# EAGLE design co326_serial_3_2 (EAGLE 9.3.0)
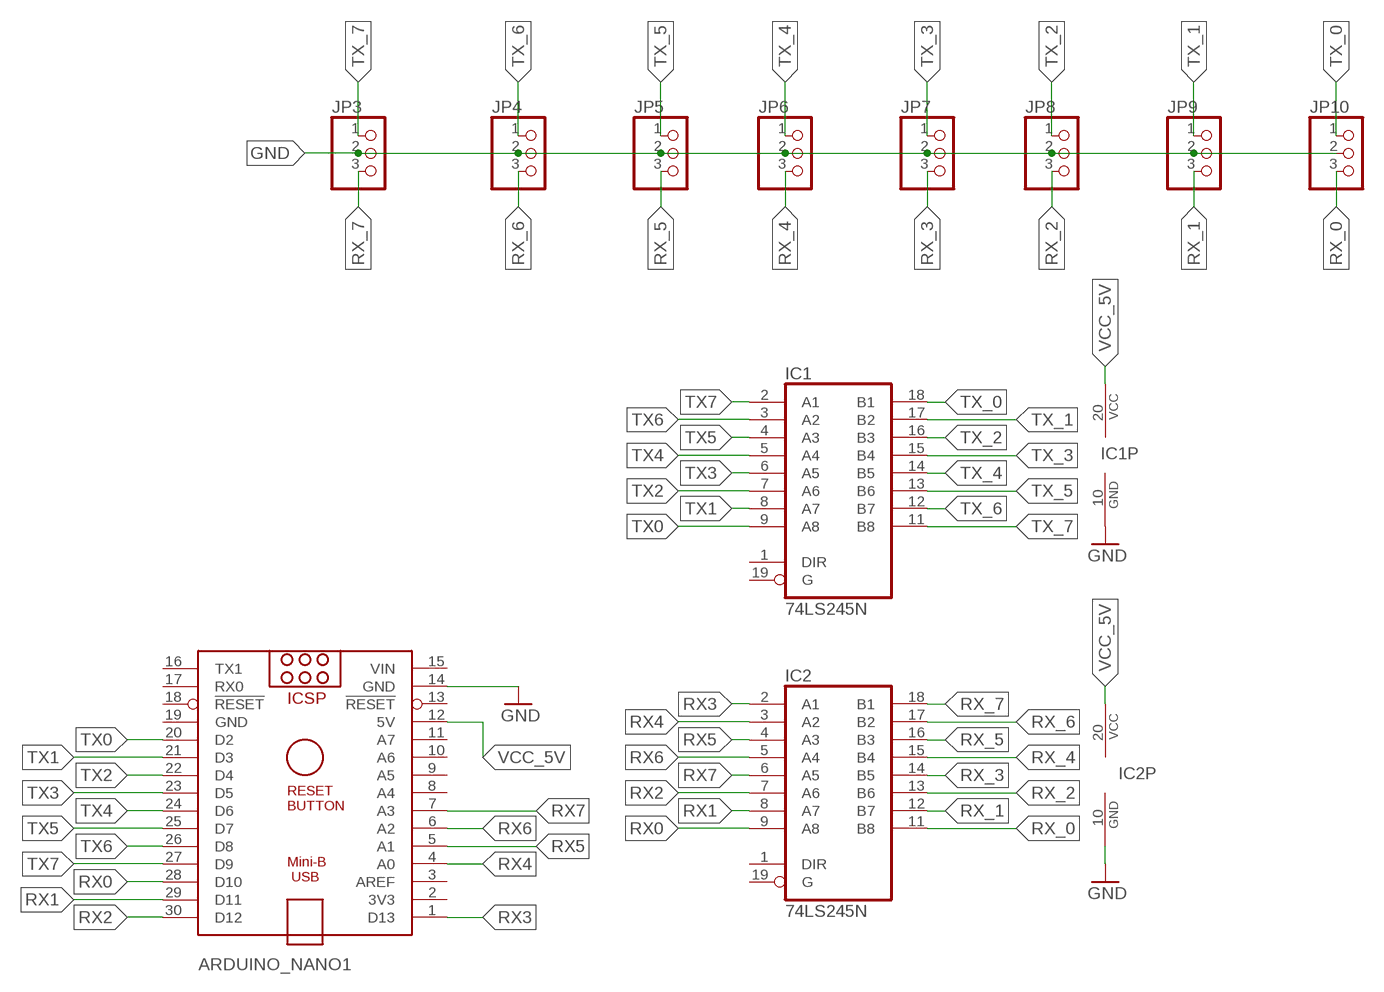
[diagram p0: schematic, sheet 1]

## Parts
ARDUINO_NANO1  ARDUINO_NANO  [ARDUINO_NANO]
IC1  74LS245N  [DIL20]
IC2  74LS245N  [DIL20]
JP3  PINHD-1X3  [1X03]
JP4  PINHD-1X3  [1X03]
JP5  PINHD-1X3  [1X03]
JP6  PINHD-1X3  [1X03]
JP7  PINHD-1X3  [1X03]
JP8  PINHD-1X3  [1X03]
JP9  PINHD-1X3  [1X03]
JP10  PINHD-1X3  [1X03]

## Nets
GND: ARDUINO_NANO1.14(GND) IC1.10(GND) IC2.10(GND) JP3.2 JP4.2 JP5.2 JP6.2 JP7.2 JP8.2 JP9.2 JP10.2
RX0: ARDUINO_NANO1.28(D10) IC2.9(A8)
RX1: ARDUINO_NANO1.29(D11) IC2.8(A7)
RX2: ARDUINO_NANO1.30(D12) IC2.7(A6)
RX3: ARDUINO_NANO1.1(D13) IC2.2(A1)
RX4: ARDUINO_NANO1.4(A0) IC2.3(A2)
RX5: ARDUINO_NANO1.5(A1) IC2.4(A3)
RX6: ARDUINO_NANO1.6(A2) IC2.5(A4)
RX7: ARDUINO_NANO1.7(A3) IC2.6(A5)
RX_0: IC2.11(B8) JP10.3
RX_1: IC2.12(B7) JP9.3
RX_2: IC2.13(B6) JP8.3
RX_3: IC2.14(B5) JP7.3
RX_4: IC2.15(B4) JP6.3
RX_5: IC2.16(B3) JP5.3
RX_6: IC2.17(B2) JP4.3
RX_7: IC2.18(B1) JP3.3
TX0: ARDUINO_NANO1.20(D2) IC1.9(A8)
TX1: ARDUINO_NANO1.21(D3) IC1.8(A7)
TX2: ARDUINO_NANO1.22(D4) IC1.7(A6)
TX3: ARDUINO_NANO1.23(D5) IC1.6(A5)
TX4: ARDUINO_NANO1.24(D6) IC1.5(A4)
TX5: ARDUINO_NANO1.25(D7) IC1.4(A3)
TX6: ARDUINO_NANO1.26(D8) IC1.3(A2)
TX7: ARDUINO_NANO1.27(D9) IC1.2(A1)
TX_0: IC1.18(B1) JP10.1
TX_1: IC1.17(B2) JP9.1
TX_2: IC1.16(B3) JP8.1
TX_3: IC1.15(B4) JP7.1
TX_4: IC1.14(B5) JP6.1
TX_5: IC1.13(B6) JP5.1
TX_6: IC1.12(B7) JP4.1
TX_7: IC1.11(B8) JP3.1
VCC_5V: ARDUINO_NANO1.12(5V) IC1.20(VCC) IC2.20(VCC)
Unconnected: ARDUINO_NANO1.2(3V3) ARDUINO_NANO1.3(AREF) ARDUINO_NANO1.8(A4) ARDUINO_NANO1.9(A5) ARDUINO_NANO1.10(A6) ARDUINO_NANO1.11(A7) ARDUINO_NANO1.13(!RESET) ARDUINO_NANO1.16(TX1) ARDUINO_NANO1.17(RX0) ARDUINO_NANO1.18(!RESET) IC1.1(DIR) IC1.19(G) IC2.1(DIR) IC2.19(G)

## Power pins joined to a net without a drawn wire
GND: ARDUINO_NANO1.19(GND)
VIN: ARDUINO_NANO1.15(VIN)

## Library data of the parts
ARDUINO_NANO1 = ArduinoNanoV30:ARDUINO_NANO: Arduino Nano V3.0 Overview: The Arduino Nano is a small, complete, and breadboard-friendly board based on the ATmega328 (Arduino Nano 3.x) or ATmega168 (Arduino Nano 2.x). It has more or less the same functionality of the Arduino Duemilanove, but in a different package. It lacks only a DC power jack, and works with a Mini-B USB cable instead of a standard one. The Nano was designed and is being produced by Gravitech. Specifications: Microcontroller Atmel ATmega168 or ATmega328 Operating Voltage (logic level) 5 V Input Voltage (recommended) 7-12 V Input Voltage (limits) 6-20 V Digital I/O Pins 14 (of which 6 provide PWM output) Analog Input Pins 8 DC Current per I/O Pin 40 mA Flash Memory 16 KB (ATmega168) or 32 KB (ATmega328) of which 2 KB used by bootloader SRAM 1 KB (ATmega168) or 2 KB (ATmega328) EEPROM 512 bytes (ATmega168) or 1 KB (ATmega328) Clock Speed 16 MHz Dimensions 0.73" x 1.70" Length 45 mm Width 18 mm Weigth 5 g Power: The Arduino Nano can be powered via the Mini-B USB connection, 6-20V unregulated external power supply (pin 30), or 5V regulated external power supply (pin 27). The power source is automatically selected to the highest voltage source. Memory: The ATmega168 has 16 KB of flash memory for storing code (of which 2 KB is used for the bootloader); the ATmega328 has 32 KB, (also with 2 KB used for the bootloader). The ATmega168 has 1 KB of SRAM and 512 bytes of EEPROM (which can be read and written with the EEPROM library); the ATmega328 has 2 KB of SRAM and 1 KB of EEPROM. Input and Output: Each of the 14 digital pins on the Nano can be used as an input or output, using pinMode(), digitalWrite(), and digitalRead() functions. They operate at 5 volts. Each pin can provide or receive a maximum of 40 mA and has an internal pull-up resistor (disconnected by default) of 20-50 kOhms. In addition, some pins have specialized functions. Visit Arduino - ArduinoBoardNano <https://www.arduino.cc/en/Main/ArduinoBoardNano>
IC1 IC2 = 74xx-us:74*245: Octal BUS TRANSCEIVER, 3-state
JP3-JP10 = pinhead:PINHD-1X3: PIN HEADER

## Board
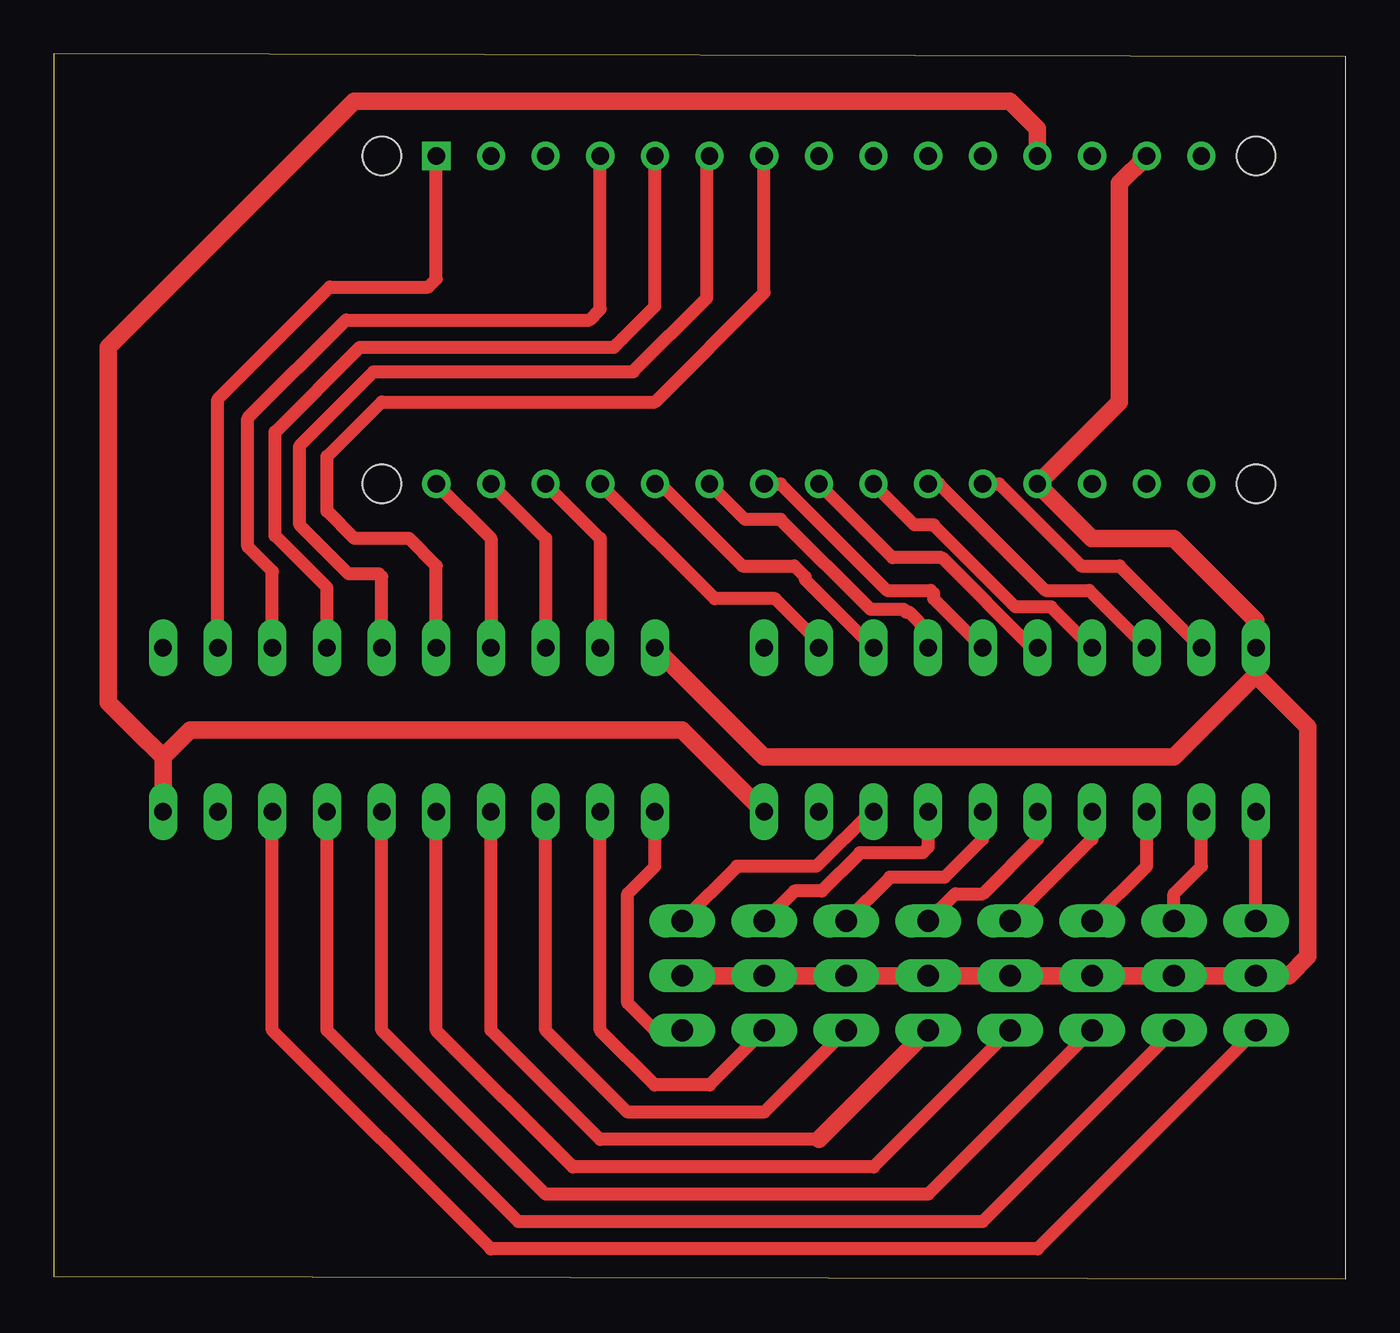
[diagram p1: board, top side]
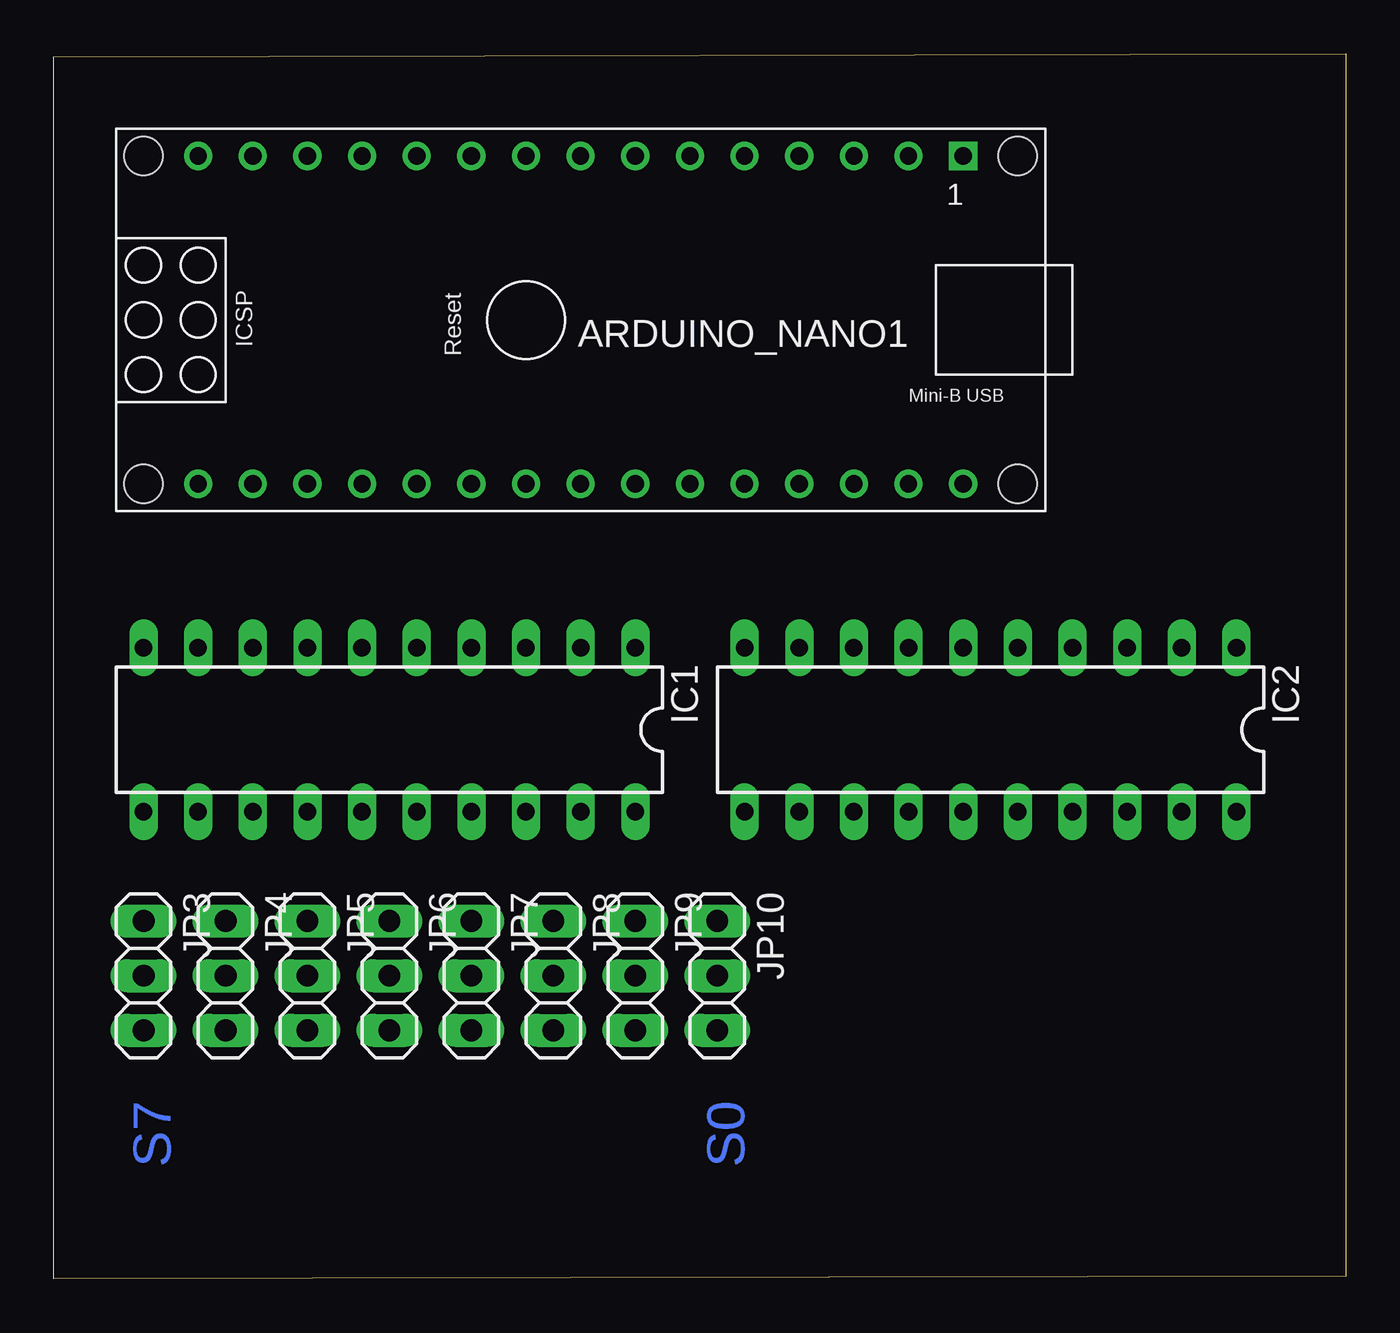
[diagram p2: board, bottom side, seen from below]

Size 60.05 x 56.95 mm. Coordinates in mm from the lower left corner, seen from the top.
Outline: 0,0.13 60.05,0 60.05,56.82 0,56.95 0,0.13
Copper layers (1*16): Top 0.035mm / dielectric 1.5mm / Bottom 0.035mm
Design rules "default": minimum track width 6mil, minimum drill 0.35mm, track to track 6mil, track to pad 6mil, pad to pad 6mil, via to via 6mil, smd to smd 6mil, copper to edge 40mil, drill to drill 6mil, minimum pad ring 10mil, minimum via ring 8mil, stop-mask expansion 4mil, vias tented up to drill 0mil, thermal gap 10mil

### Footprints (pad centres in the part's own frame; a part is rotated, then mirrored left to right if it is on the bottom)
ARDUINO_NANO = drill 0.8 square: 1 -20.32,-7.62 | drill 0.8: 2 -17.78,-7.62; 3 -15.24,-7.62; 4 -12.7,-7.62; 5 -10.16,-7.62; 6 -7.62,-7.62; 7 -5.08,-7.62; 8 -2.54,-7.62; 9 0,-7.62; 10 2.54,-7.62; 11 5.08,-7.62; 12 7.62,-7.62; 13 10.16,-7.62; 14 12.7,-7.62; 15 15.24,-7.62; 16 15.24,7.62; 17 12.7,7.62; 18 10.16,7.62; 19 7.62,7.62; 20 5.08,7.62; 21 2.54,7.62; 22 0,7.62; 23 -2.54,7.62; 24 -5.08,7.62; 25 -7.62,7.62; 26 -10.16,7.62; 27 -12.7,7.62; 28 -15.24,7.62; 29 -17.78,7.62; 30 -20.32,7.62 | hole 1.778: -22.86,-7.62; -22.86,7.62; 17.78,7.62; 17.78,-7.62
DIL20 = drill 0.813 long: 1 -11.43,-3.81; 2 -8.89,-3.81; 3 -6.35,-3.81; 4 -3.81,-3.81; 5 -1.27,-3.81; 6 1.27,-3.81; 7 3.81,-3.81; 8 6.35,-3.81; 9 8.89,-3.81; 10 11.43,-3.81; 11 11.43,3.81; 12 8.89,3.81; 13 6.35,3.81; 14 3.81,3.81; 15 1.27,3.81; 16 -1.27,3.81; 17 -3.81,3.81; 18 -6.35,3.81; 19 -8.89,3.81; 20 -11.43,3.81
1X03 = drill 1.016 long: 1 -2.54,0; 2 0,0; 3 2.54,0

### Placement (x,y rotation side)
ARDUINO_NANO1  38.1,44.58 180 bottom
IC1  44.45,25.53 180 bottom
IC2  16.51,25.53 180 bottom
JP3  55.88,14.1 270 bottom
JP4  52.07,14.1 270 bottom
JP5  48.26,14.1 270 bottom
JP6  44.45,14.1 270 bottom
JP7  40.64,14.1 270 bottom
JP8  36.83,14.1 270 bottom
JP9  33.02,14.1 270 bottom
JP10  29.21,14.1 270 bottom

### Tracks (layer width: path | path; a pad name or v marks a point on that pad's centre or on a via)
GND
  Top 0.152: 55.88,28.07 IC1.10
  Top 0.813: IC2.10 33.02,24.26 52.07,24.26 55.88,28.07 | ARDUINO_NANO1.14 49.53,50.93 49.53,40.77 ARDUINO_NANO1.19 48.26,34.42 52.07,34.42 55.88,30.61 IC1.10 55.88,28.07 | JP10.2 JP9.2 JP8.2 JP7.2 JP6.2 JP5.2 JP4.2 JP3.2 57.4,14.1 58.29,14.99 58.29,25.65 55.88,28.07
RX0
  Top 0.61: ARDUINO_NANO1.28 25.4,34.42 IC2.9
RX1
  Top 0.61: ARDUINO_NANO1.29 22.86,34.42 IC2.8
RX2
  Top 0.61: ARDUINO_NANO1.30 20.32,34.42 IC2.7
RX3
  Top 0.61: IC2.2 7.62,40.89 12.83,46.1 17.4,46.1 17.78,46.48 ARDUINO_NANO1.1
RX4
  Top 0.61: IC2.3 10.16,32.89 9.02,34.04 9.02,40.01 13.59,44.58 24.89,44.58 25.4,45.09 ARDUINO_NANO1.4
RX5
  Top 0.61: IC2.4 12.7,32.13 10.29,34.54 10.29,39.37 14.22,43.31 25,43.31 | 25,43.31 26.04,43.31 | 26.43,43.7 26.16,43.43 | 26.43,43.7 27.94,45.21 ARDUINO_NANO1.5 | 25,43.31 26.04,43.31 | 26.04,43.31 26.43,43.7
RX6
  Top 0.61: IC2.5 15.24,32.64 15.11,32.77 13.72,32.77 11.43,35.05 11.43,38.73 14.86,42.16 26.92,42.16 30.35,45.59 30.35,52.07 ARDUINO_NANO1.6
RX7
  Top 0.61: IC2.6 17.78,33.15 16.51,34.42 13.97,34.42 12.7,35.69 12.7,38.23 15.24,40.77 27.94,40.77 33.02,45.85 ARDUINO_NANO1.7
RX_0
  Top 0.61: JP10.3 27.94,11.56 26.67,12.83 26.67,17.91 27.94,19.18 IC2.11
RX_1
  Top 0.61: JP9.3 30.48,9.02 27.94,9.02 25.4,11.56 IC2.12
RX_2
  Top 0.61: JP8.3 33.02,7.75 26.67,7.75 22.86,11.56 IC2.13
RX_3
  Top 0.61: IC2.14 20.32,11.56 25.4,6.48 35.56,6.48
  Top 0.813: JP7.3 35.56,6.48
RX_4
  Top 0.61: JP6.3 38.1,5.21 24.13,5.21 17.78,11.56 IC2.15
RX_5
  Top 0.61: JP5.3 40.64,3.94 22.86,3.94 15.24,11.56 IC2.16
RX_6
  Top 0.61: IC2.17 12.7,11.56 21.59,2.67 43.18,2.67 JP4.3
RX_7
  Top 0.61: JP3.3 45.72,1.4 20.32,1.4 10.16,11.56 IC2.18
TX0
  Top 0.61: ARDUINO_NANO1.20 43.94,36.96 47.75,33.15 49.53,33.15 IC1.9
TX1
  Top 0.61: IC1.8 48.13,32 46.1,32 41.15,36.96 ARDUINO_NANO1.21
TX2
  Top 0.61: IC1.7 46.35,31.24 44.83,31.24 44.7,31.24 40.89,35.05 40.01,35.05 ARDUINO_NANO1.22
TX3
  Top 0.61: IC1.6 45.47,29.34 41.27,33.53 38.99,33.53 ARDUINO_NANO1.23
TX4
  Top 0.61: ARDUINO_NANO1.24 33.78,36.96 38.73,32 40.77,32 40.89,31.88 40.89,31.62 IC1.5
TX5
  Top 0.61: IC1.4 40.64,30.1 39.75,30.99 39.62,30.99 39.5,31.11 37.97,31.11 33.78,35.31 32.13,35.31 ARDUINO_NANO1.25
TX6
  Top 0.61: ARDUINO_NANO1.26 28.19,36.96 32,33.15 34.42,33.15 34.92,32.64 34.92,32.51 IC1.3
TX7
  Top 0.61: IC1.2 35.56,29.59 33.53,31.62 30.73,31.62 ARDUINO_NANO1.27
TX_0
  Top 0.61: IC1.18 37.97,21.72 35.43,19.18 31.75,19.18 JP10.1
TX_1
  Top 0.61: IC1.17 40.64,20.07 40.39,19.81 37.47,19.81 35.69,18.03 34.42,18.03 JP9.1
TX_2
  Top 0.61: IC1.16 43.18,20.45 41.4,18.67 38.86,18.67 JP8.1
TX_3
  Top 0.61: IC1.15 45.72,20.45 43.18,17.91 41.91,17.91 JP7.1
TX_4
  Top 0.61: JP6.1 48.26,20.45 IC1.14
TX_5
  Top 0.61: JP5.1 50.8,19.18 IC1.13
TX_6
  Top 0.61: JP4.1 52.07,17.91 53.34,19.18 IC1.12
TX_7
  Top 0.61: JP3.1 IC1.11
VCC_5V
  Top 0.813: IC1.20 29.21,25.53 6.35,25.53 5.08,24.26 | 5.08,24.26 3.81,25.53 2.54,26.8 2.54,43.31 13.97,54.74 44.45,54.74 45.72,53.47 ARDUINO_NANO1.12 | IC2.20 5.08,24.26

### Text on the board
Bottom: S0 | S7